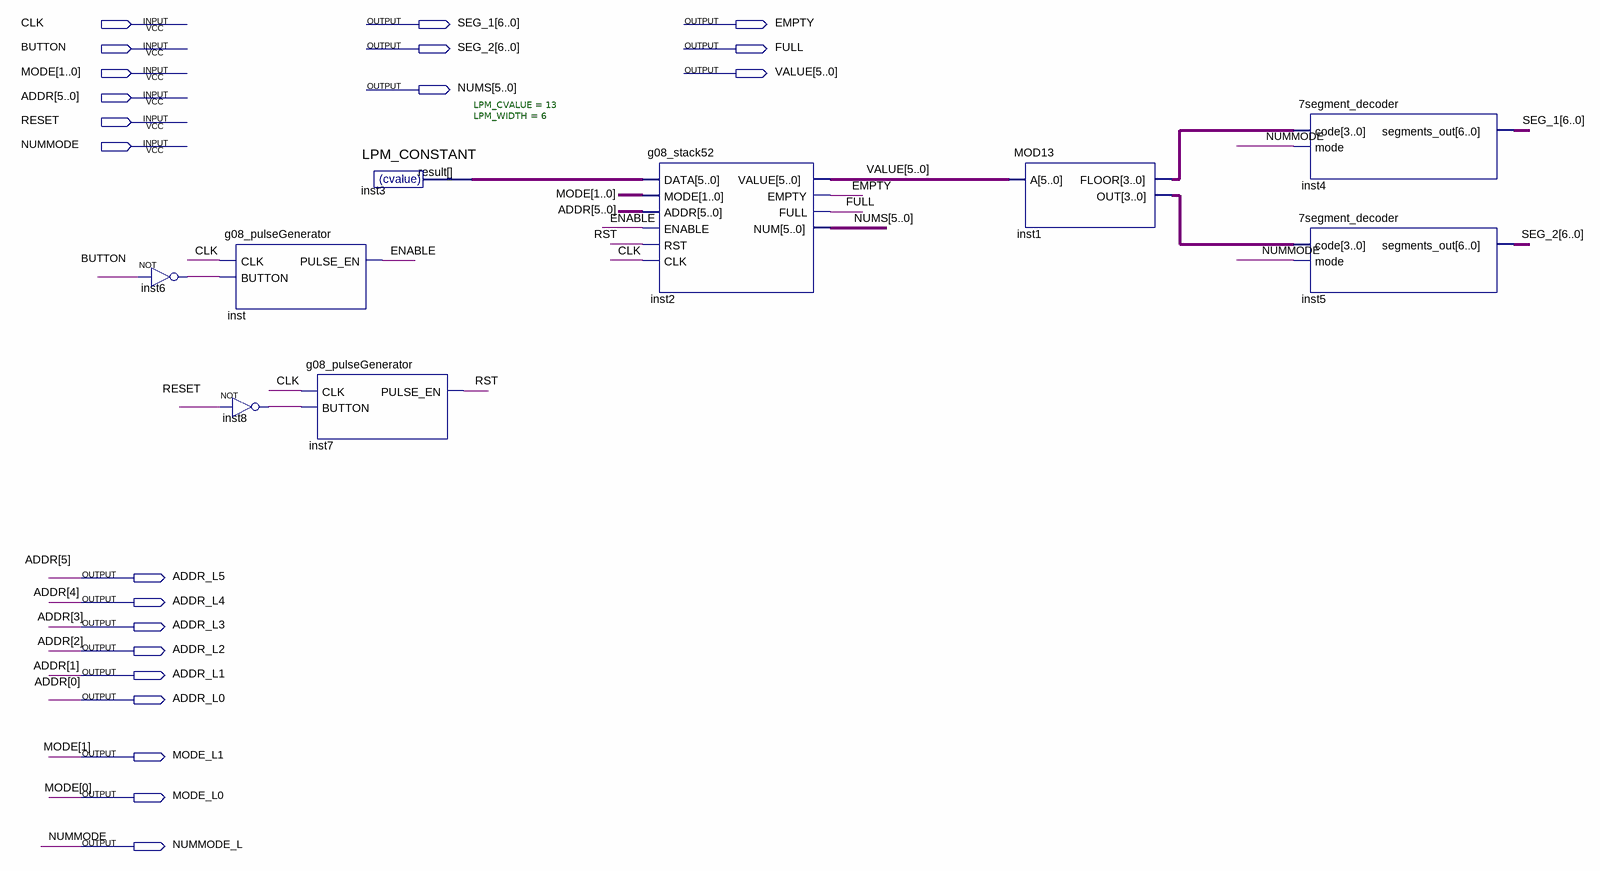
[diagram p0: schematic sheet]
// Quartus schematic g08_pulseEnabler.bdf as structural Verilog: 9 symbols, 21 pins
module g08_pulseEnabler (
  input  CLK,
  input  BUTTON,
  input  [1:0] MODE,
  input  [5:0] ADDR,
  input  RESET,
  input  NUMMODE,
  output [6:0] SEG_1,
  output EMPTY,
  output [6:0] SEG_2,
  output FULL,
  output [5:0] VALUE,
  output [5:0] NUMS,
  output ADDR_L5,
  output ADDR_L4,
  output ADDR_L3,
  output ADDR_L2,
  output ADDR_L1,
  output ADDR_L0,
  output MODE_L1,
  output MODE_L0,
  output NUMMODE_L
);

  wire ENABLE, inst6_out, inst8_out, RST;
  wire [3:0] inst1_floor, inst1_out;
  wire [5:0] inst3_result;

  not inst6 (inst6_out, BUTTON);
  g08_pulseGenerator inst (.CLK(CLK), .BUTTON(inst6_out), .PULSE_EN(ENABLE));
  not inst8 (inst8_out, RESET);
  g08_pulseGenerator inst7 (.CLK(CLK), .BUTTON(inst8_out), .PULSE_EN(RST));
  LPM_CONSTANT #(.LPM_CVALUE(13), .LPM_WIDTH(6)) inst3 (.result(inst3_result));
  g08_stack52 inst2 (
    .DATA(inst3_result), .MODE(MODE), .ADDR(ADDR), .ENABLE(ENABLE), .RST(RST), .CLK(CLK), .VALUE(VALUE),
    .EMPTY(EMPTY), .FULL(FULL), .NUM(NUMS));
  MOD13 inst1 (.A(VALUE), .FLOOR(inst1_floor), .OUT(inst1_out));
  \7segment_decoder  inst4 (.code(inst1_floor), .mode(NUMMODE), .segments_out(SEG_1));
  \7segment_decoder  inst5 (.code(inst1_out), .mode(NUMMODE), .segments_out(SEG_2));

  assign ADDR_L0 = ADDR[0];
  assign ADDR_L1 = ADDR[1];
  assign ADDR_L2 = ADDR[2];
  assign ADDR_L3 = ADDR[3];
  assign ADDR_L4 = ADDR[4];
  assign ADDR_L5 = ADDR[5];
  assign MODE_L0 = MODE[0];
  assign MODE_L1 = MODE[1];
  assign NUMMODE_L = NUMMODE;
endmodule
